# EAGLE design PCB - Pro Micro (EAGLE 9.6.2)
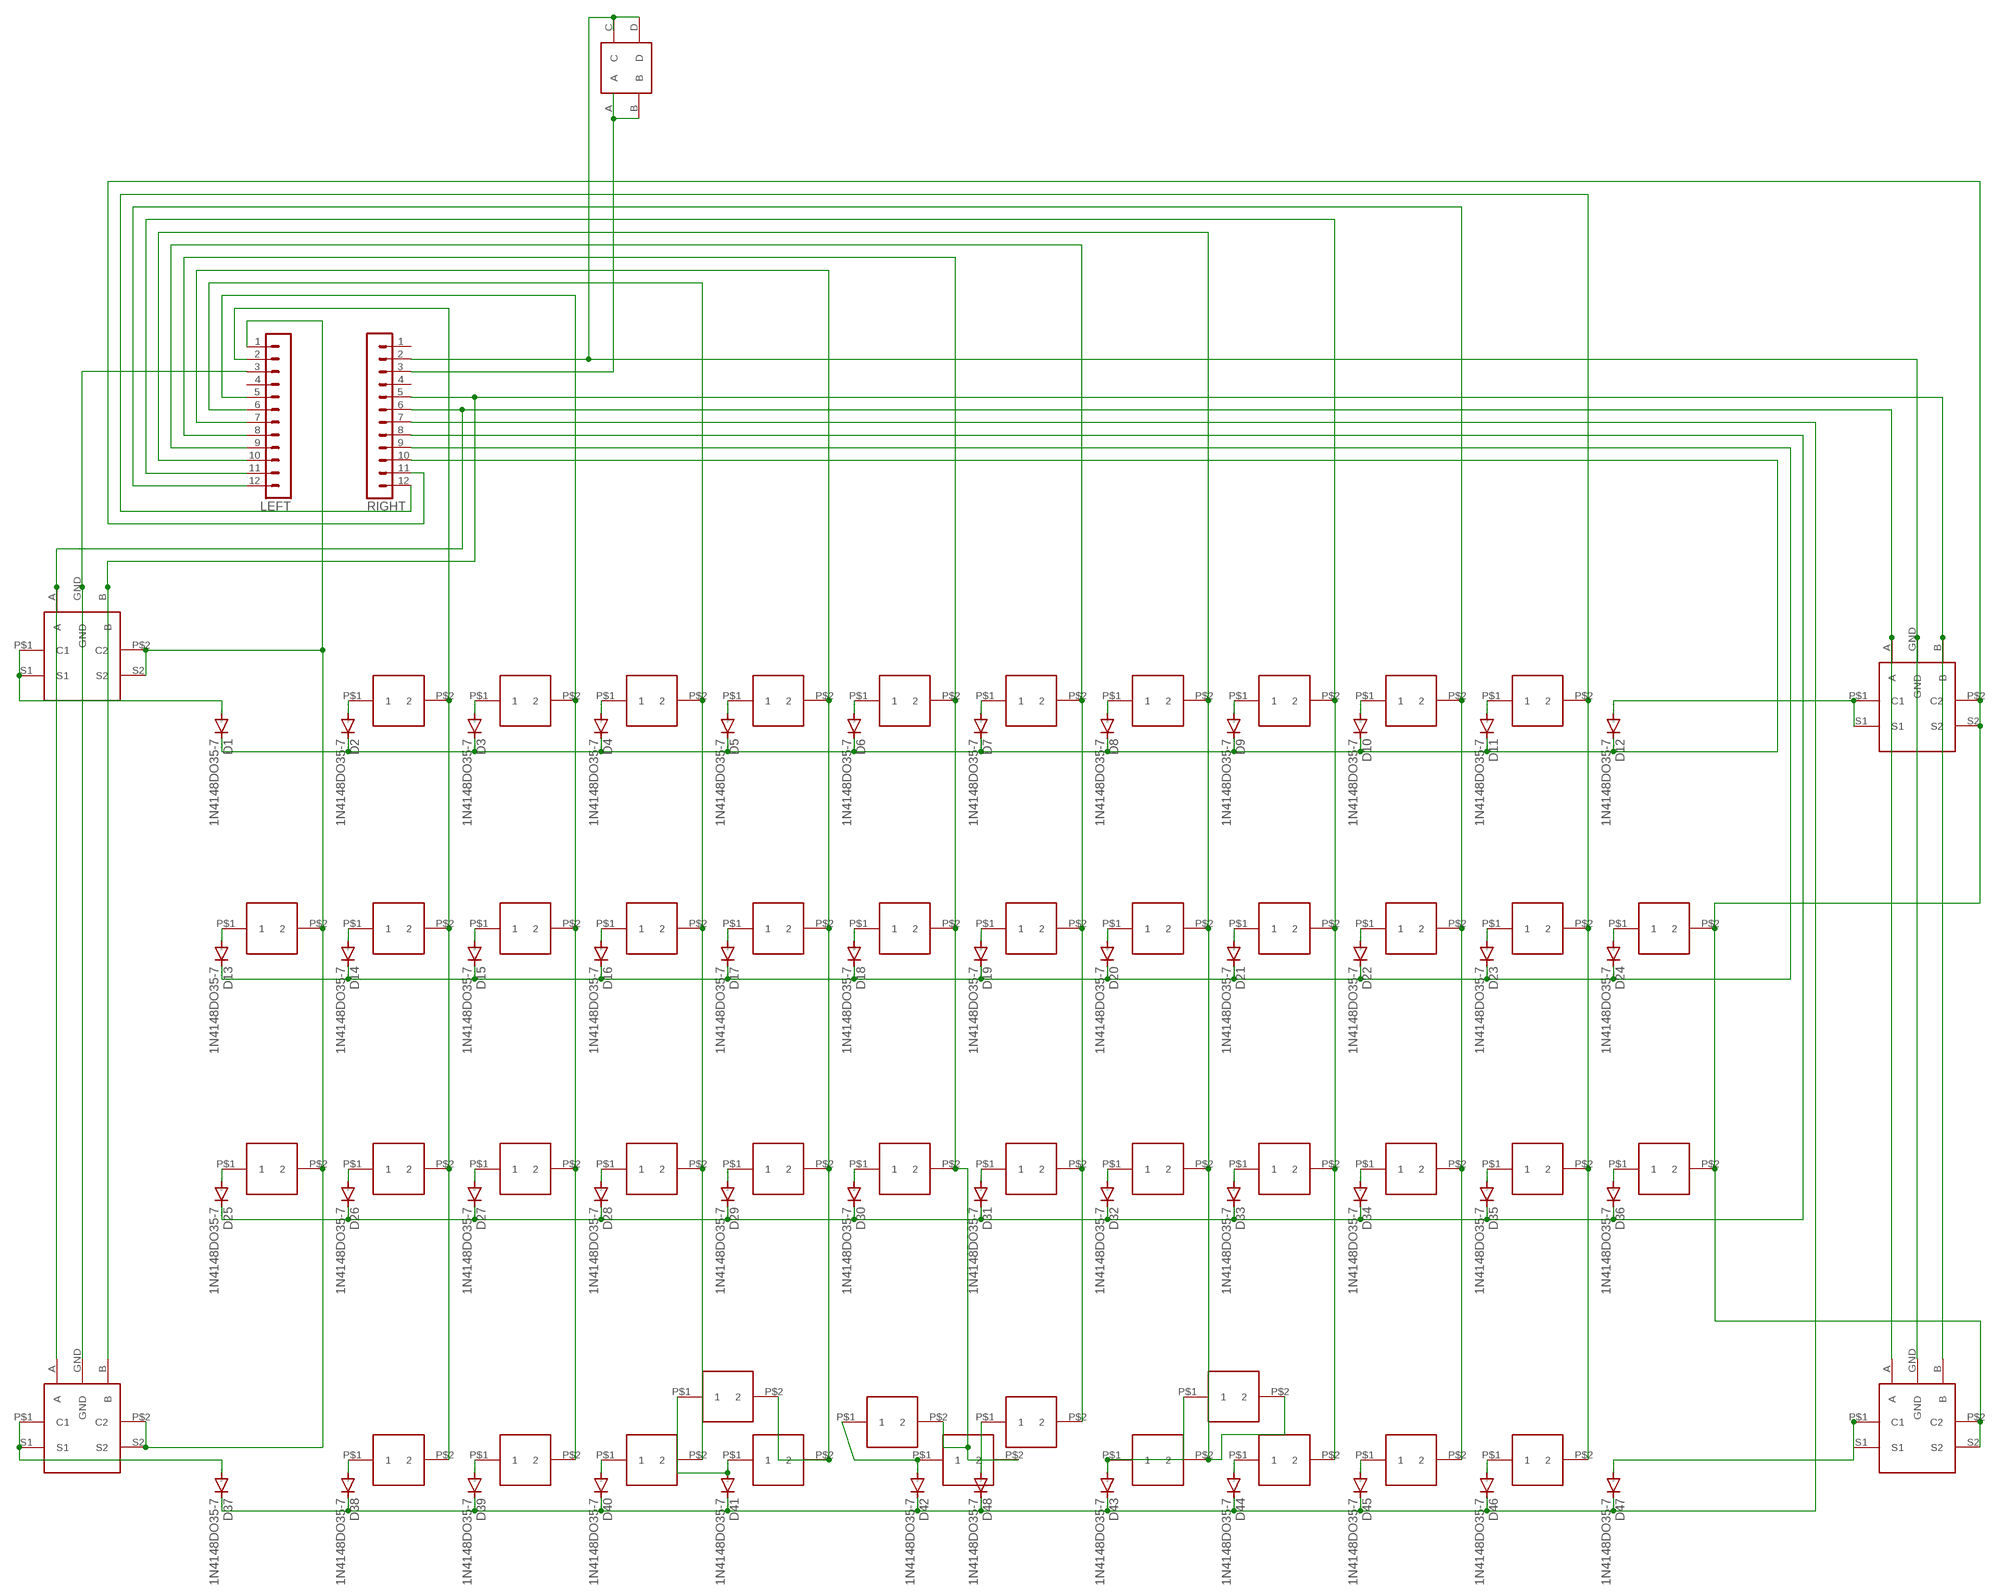
[diagram p0: schematic, sheet 1]

## Parts
1  CHERRY-SOLDER  [CHERRY-SOLDER]
2  CHERRY-SOLDER  [CHERRY-SOLDER]
3  CHERRY-SOLDER  [CHERRY-SOLDER]
4  CHERRY-SOLDER  [CHERRY-SOLDER]
12  CHERRY-SOLDER  [CHERRY-SOLDER]
13  CHERRY-SOLDER  [CHERRY-SOLDER]
14  CHERRY-SOLDER  [CHERRY-SOLDER]
15  CHERRY-SOLDER  [CHERRY-SOLDER]
16  CHERRY-SOLDER  [CHERRY-SOLDER]
17  CHERRY-SOLDER  [CHERRY-SOLDER]
18  CHERRY-SOLDER  [CHERRY-SOLDER]
19  CHERRY-SOLDER  [CHERRY-SOLDER]
21  CHERRY-SOLDER  [CHERRY-SOLDER]
22  CHERRY-SOLDER  [CHERRY-SOLDER]
23  CHERRY-SOLDER  [CHERRY-SOLDER]
24  CHERRY-SOLDER  [CHERRY-SOLDER]
25  CHERRY-SOLDER  [CHERRY-SOLDER]
26  CHERRY-SOLDER  [CHERRY-SOLDER]
27  CHERRY-SOLDER  [CHERRY-SOLDER]
28  CHERRY-SOLDER  [CHERRY-SOLDER]
29  CHERRY-SOLDER  [CHERRY-SOLDER]
31  CHERRY-SOLDER  [CHERRY-SOLDER]
32  CHERRY-SOLDER  [CHERRY-SOLDER]
33  CHERRY-SOLDER  [CHERRY-SOLDER]
34  CHERRY-SOLDER  [CHERRY-SOLDER]
35  CHERRY-SOLDER  [CHERRY-SOLDER]
36  CHERRY-SOLDER  [CHERRY-SOLDER]
37  CHERRY-SOLDER  [CHERRY-SOLDER]
38  CHERRY-SOLDER  [CHERRY-SOLDER]
39  CHERRY-SOLDER  [CHERRY-SOLDER]
42  CHERRY-SOLDER  [CHERRY-SOLDER]
43  CHERRY-SOLDER  [CHERRY-SOLDER]
44  CHERRY-SOLDER  [CHERRY-SOLDER]
45  CHERRY-SOLDER  [CHERRY-SOLDER]
46  CHERRY-SOLDER  [CHERRY-SOLDER]
47  CHERRY-SOLDER  [CHERRY-SOLDER]
48  CHERRY-SOLDER  [CHERRY-SOLDER]
49  CHERRY-SOLDER  [CHERRY-SOLDER]
110  CHERRY-SOLDER  [CHERRY-SOLDER]
111  CHERRY-SOLDER  [CHERRY-SOLDER]
210  CHERRY-SOLDER  [CHERRY-SOLDER]
211  CHERRY-SOLDER  [CHERRY-SOLDER]
212  CHERRY-SOLDER  [CHERRY-SOLDER]
310  CHERRY-SOLDER  [CHERRY-SOLDER]
311  CHERRY-SOLDER  [CHERRY-SOLDER]
312  CHERRY-SOLDER  [CHERRY-SOLDER]
410  CHERRY-SOLDER  [CHERRY-SOLDER]
D1  1N4148DO35-7  [DO35-7]
D2  1N4148DO35-7  [DO35-7]
D3  1N4148DO35-7  [DO35-7]
D4  1N4148DO35-7  [DO35-7]
D5  1N4148DO35-7  [DO35-7]
D6  1N4148DO35-7  [DO35-7]
D7  1N4148DO35-7  [DO35-7]
D8  1N4148DO35-7  [DO35-7]
D9  1N4148DO35-7  [DO35-7]
D10  1N4148DO35-7  [DO35-7]
D11  1N4148DO35-7  [DO35-7]
D12  1N4148DO35-7  [DO35-7]
D13  1N4148DO35-7  [DO35-7]
D14  1N4148DO35-7  [DO35-7]
D15  1N4148DO35-7  [DO35-7]
D16  1N4148DO35-7  [DO35-7]
D17  1N4148DO35-7  [DO35-7]
D18  1N4148DO35-7  [DO35-7]
D19  1N4148DO35-7  [DO35-7]
D20  1N4148DO35-7  [DO35-7]
D21  1N4148DO35-7  [DO35-7]
D22  1N4148DO35-7  [DO35-7]
D23  1N4148DO35-7  [DO35-7]
D24  1N4148DO35-7  [DO35-7]
D25  1N4148DO35-7  [DO35-7]
D26  1N4148DO35-7  [DO35-7]
D27  1N4148DO35-7  [DO35-7]
D28  1N4148DO35-7  [DO35-7]
D29  1N4148DO35-7  [DO35-7]
D30  1N4148DO35-7  [DO35-7]
D31  1N4148DO35-7  [DO35-7]
D32  1N4148DO35-7  [DO35-7]
D33  1N4148DO35-7  [DO35-7]
D34  1N4148DO35-7  [DO35-7]
D35  1N4148DO35-7  [DO35-7]
D36  1N4148DO35-7  [DO35-7]
D37  1N4148DO35-7  [DO35-7]
D38  1N4148DO35-7  [DO35-7]
D39  1N4148DO35-7  [DO35-7]
D40  1N4148DO35-7  [DO35-7]
D41  1N4148DO35-7  [DO35-7]
D42  1N4148DO35-7  [DO35-7]
D43  1N4148DO35-7  [DO35-7]
D44  1N4148DO35-7  [DO35-7]
D45  1N4148DO35-7  [DO35-7]
D46  1N4148DO35-7  [DO35-7]
D47  1N4148DO35-7  [DO35-7]
D48  1N4148DO35-7  [DO35-7]
LEFT  MA12-1  [MA12-1]
RIGHT  MA12-1  [MA12-1]
U$1  BUTTON  [BUTTON]
U$2  CHERRY-ENCODER  [CHERRY-ENCODER]
U$3  CHERRY-ENCODER  [CHERRY-ENCODER]
U$4  CHERRY-ENCODER  [CHERRY-ENCODER]
U$5  CHERRY-ENCODER  [CHERRY-ENCODER]

## Nets
N$1: 3.P$2 15.P$2 25.P$2 35.P$2 45.P$2 LEFT.7
N$2: 12.P$1 D2.A
N$3: 13.P$1 D3.A
N$4: 14.P$1 D4.A
N$5: 15.P$1 D5.A
N$6: 16.P$1 D6.A
N$7: 17.P$1 D7.A
N$8: 18.P$1 D8.A
N$9: 19.P$1 D9.A
N$10: 110.P$1 D10.A
N$11: 111.P$1 D11.A
N$12: D12.A U$2.P$1(C1) U$2.S1
N$13: 21.P$1 D13.A
N$14: 22.P$1 D14.A
N$15: 23.P$1 D15.A
N$16: 24.P$1 D16.A
N$17: 25.P$1 D17.A
N$18: 26.P$1 D18.A
N$19: 27.P$1 D19.A
N$20: 28.P$1 D20.A
N$21: 29.P$1 D21.A
N$22: 210.P$1 D22.A
N$23: 211.P$1 D23.A
N$24: 212.P$1 D24.A
N$25: 31.P$1 D25.A
N$26: 32.P$1 D26.A
N$27: 33.P$1 D27.A
N$28: 34.P$1 D28.A
N$29: 35.P$1 D29.A
N$30: 36.P$1 D30.A
N$31: 37.P$1 D31.A
N$32: 38.P$1 D32.A
N$33: 39.P$1 D33.A
N$34: 310.P$1 D34.A
N$35: 311.P$1 D35.A
N$36: 312.P$1 D36.A
N$37: 21.P$2 31.P$2 LEFT.1 U$3.P$2(C2) U$3.S2 U$4.P$2(C2) U$4.S2
N$38: 42.P$1 D38.A
N$39: 43.P$1 D39.A
N$40: 44.P$1 D40.A
N$41: 3.P$1 45.P$1 D41.A
N$42: 1.P$1 46.P$1 D42.A
N$43: 4.P$1 47.P$1 D43.A
N$44: 48.P$1 D44.A
N$45: 49.P$1 D45.A
N$46: 410.P$1 D46.A
N$47: D47.A U$5.P$1(C1) U$5.S1
N$49: D37.A U$4.P$1(C1) U$4.S1
N$50: 212.P$2 312.P$2 RIGHT.11 U$2.P$2(C2) U$2.S2 U$5.P$2(C2) U$5.S2
N$51: 12.P$2 22.P$2 32.P$2 42.P$2 LEFT.2
N$55: D37.C D38.C D39.C D40.C D41.C D42.C D43.C D44.C D45.C D46.C D47.C D48.C RIGHT.7
N$56: D1.C D2.C D3.C D4.C D5.C D6.C D7.C D8.C D9.C D10.C D11.C D12.C RIGHT.10
N$57: D13.C D14.C D15.C D16.C D17.C D18.C D19.C D20.C D21.C D22.C D23.C D24.C RIGHT.9
N$58: D25.C D26.C D27.C D28.C D29.C D30.C D31.C D32.C D33.C D34.C D35.C D36.C RIGHT.8
N$59: RIGHT.2 U$1.C U$1.D U$2.GND U$5.GND
N$60: LEFT.3 U$3.GND U$4.GND
N$63: 13.P$2 23.P$2 33.P$2 43.P$2 LEFT.5
N$64: 111.P$2 211.P$2 311.P$2 410.P$2 RIGHT.12
N$67: RIGHT.6 U$2.A U$3.A U$4.A U$5.A
N$68: D1.A U$3.P$1(C1) U$3.S1
N$69: 14.P$2 24.P$2 34.P$2 44.P$2 LEFT.6
N$70: RIGHT.5 U$2.B U$3.B U$4.B U$5.B
N$72: 2.P$1 D48.A
N$74: 2.P$2 17.P$2 27.P$2 37.P$2 LEFT.9
N$75: 49.P$2 110.P$2 210.P$2 310.P$2 LEFT.12
N$93: 1.P$2 16.P$2 26.P$2 36.P$2 46.P$2 LEFT.8
N$123: RIGHT.3 U$1.A U$1.B
N$126: 4.P$2 18.P$2 28.P$2 38.P$2 47.P$2 LEFT.10
N$128: 19.P$2 29.P$2 39.P$2 48.P$2 LEFT.11
Unconnected: LEFT.4 RIGHT.1 RIGHT.4

## Library data of the parts
1-4 12-19 21-29 31-39 42-49 110 111 210-212 310-312 410 = Volume_V1:CHERRY-SOLDER
D1-D48 = diode:1N4148: DIODE high speed (Philips)
LEFT RIGHT = con-lstb:MA12-1: PIN HEADER; OC_FARNELL: unknown; OC_NEWARK: unknown
U$1 = Volume_V1:BUTTON
U$2-U$5 = Volume_V1:CHERRY-ENCODER

## Board
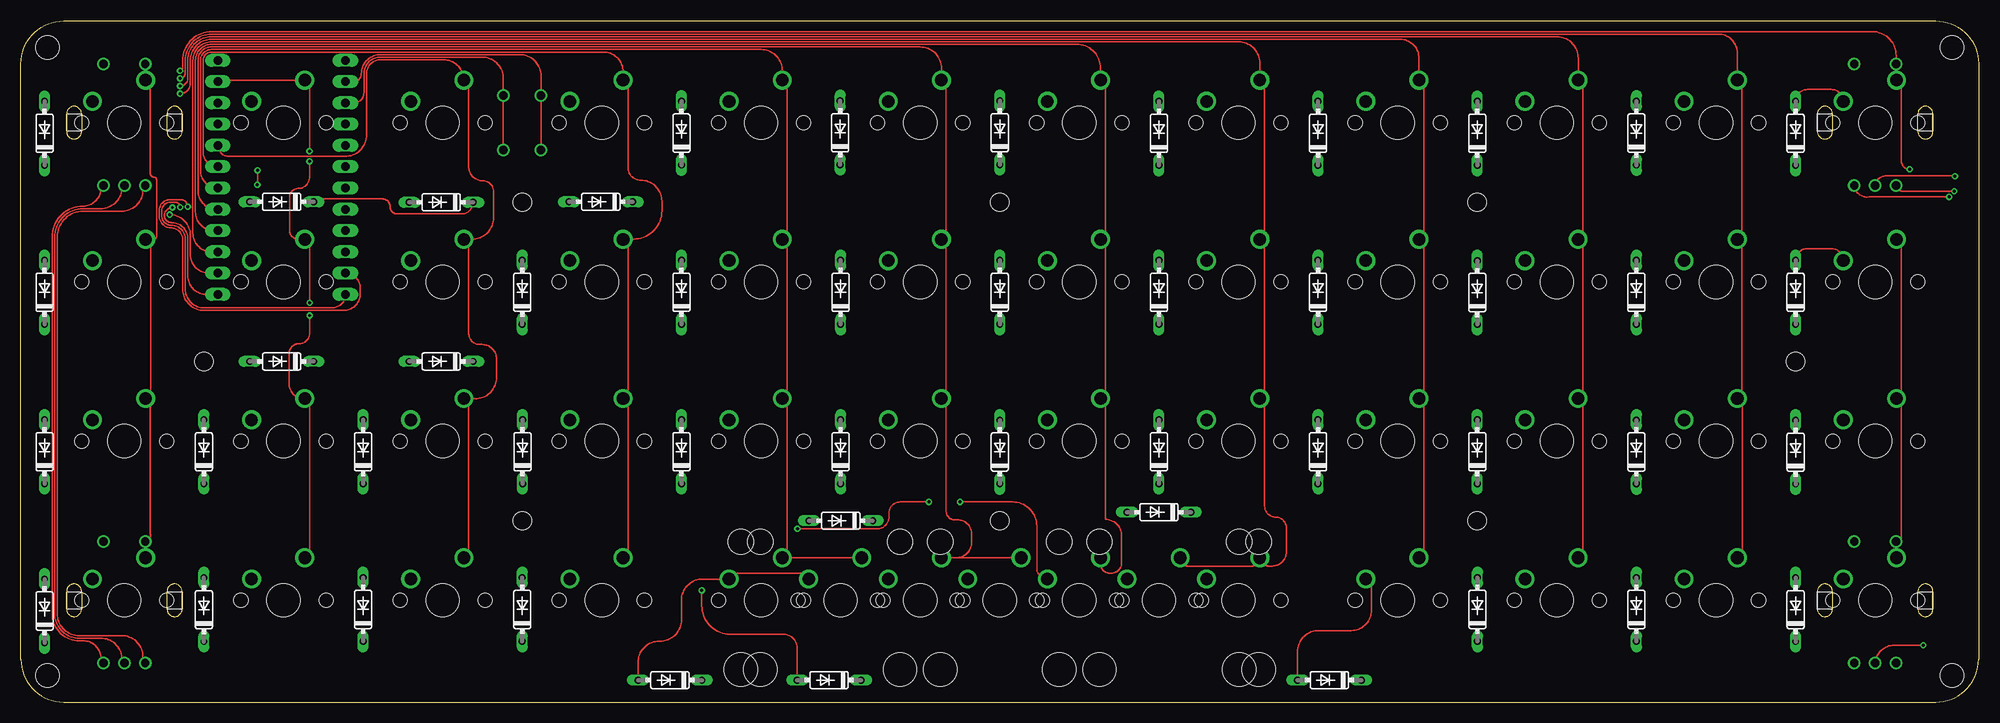
[diagram p1: board, top side]
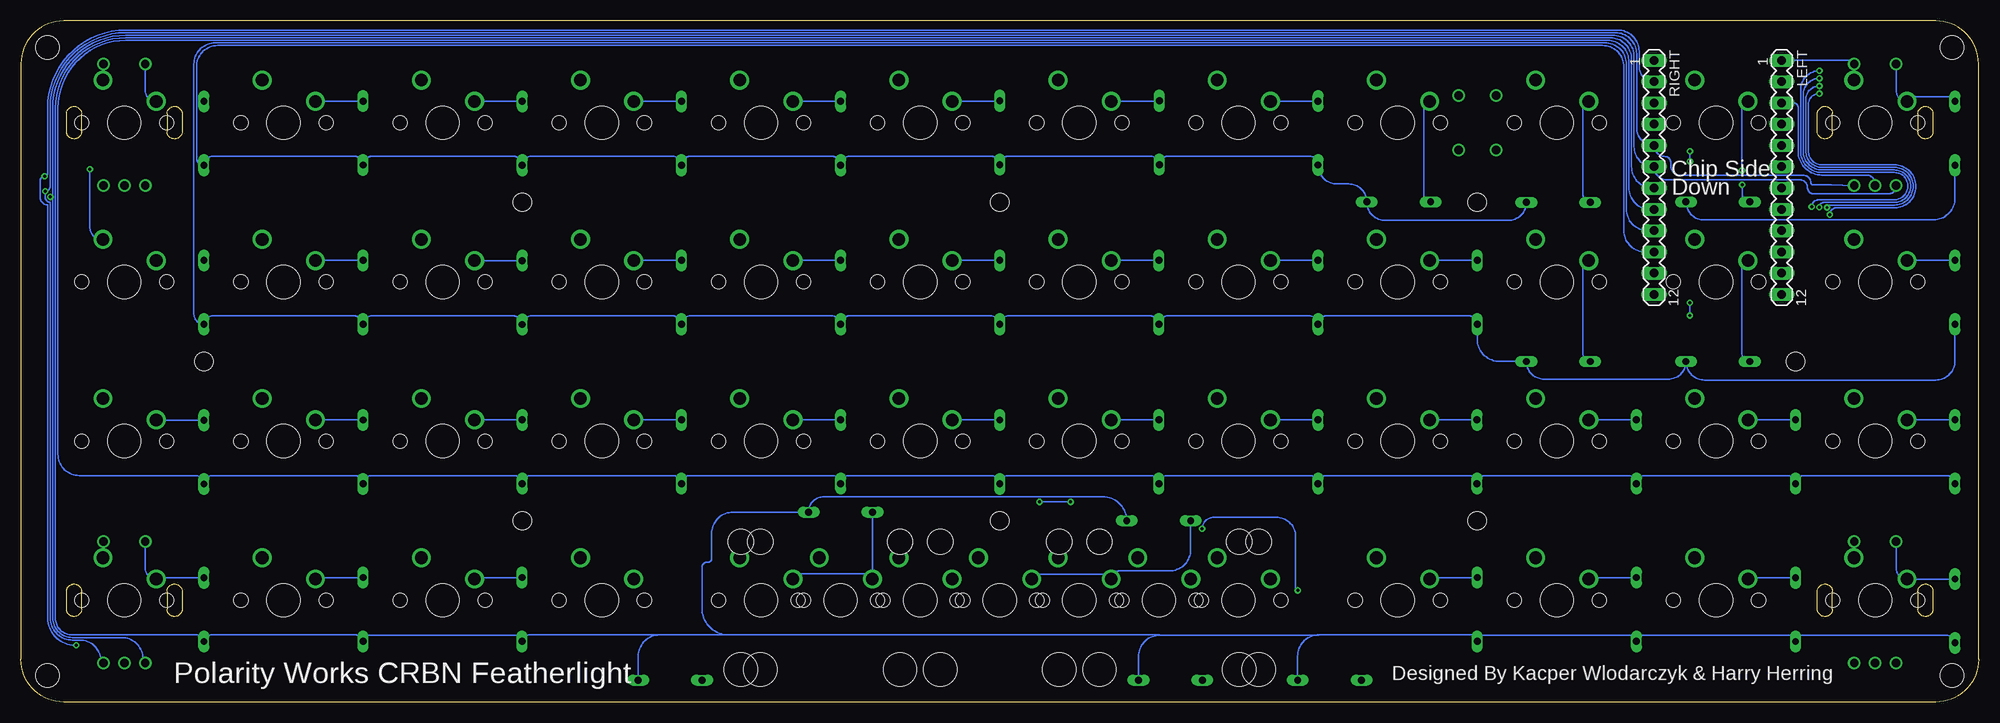
[diagram p2: board, bottom side, seen from below]

Size 233.68 x 81.28 mm. Coordinates in mm from the lower left corner, seen from the top.
Outline: 5.08,0 228.6,0 arc90 233.68,5.08 233.68,76.2 arc90 228.6,81.28 5.08,81.28 arc90 0,76.2 0,5.08 arc90 5.08,0
Copper layers (1*16): Top 0.035mm / dielectric 1.5mm / Bottom 0.035mm
Design rules "default": minimum track width 6mil, minimum drill 0.35mm, track to track 6mil, track to pad 6mil, pad to pad 6mil, via to via 6mil, smd to smd 6mil, copper to edge 40mil, drill to drill 6mil, minimum pad ring 10mil, minimum via ring 8mil, stop-mask expansion 4mil, vias tented up to drill 0mil, thermal gap 10mil
Holes 2.79 mm at 3.17,3.17 3.17,78.11 230.5,78.11 230.5,3.17
Holes 2.2 mm at 116.84,59.64 116.84,21.64 173.84,21.64 211.84,40.64 173.84,59.64 59.84,59.64 59.84,21.64 21.84,40.64
Holes 3.05 mm at 109.74,19.12 128.74,19.12 104.94,19.12 85.94,19.12 123.94,19.12 147.74,19.12 88.27,19.12 145.41,19.12
Holes 3.99 mm at 109.74,3.88 128.74,3.88 104.94,3.88 85.94,3.88 123.94,3.88 147.74,3.88 88.27,3.88 145.41,3.88

### Footprints (pad centres in the part's own frame; a part is rotated, then mirrored left to right if it is on the bottom)
CHERRY-SOLDER = drill 1.499: P$1 -3.81,2.54; P$2 2.54,5.08 | hole 3.988: 0,0 | hole 1.702: -5.08,0; 5.08,0
DO35-7 = drill 0.813 long: A 3.81,0; C -3.81,0
MA12-1 = drill 1.016 long: 1 -13.97,0; 2 -11.43,0; 3 -8.89,0; 4 -6.35,0; 5 -3.81,0; 6 -1.27,0; 7 1.27,0; 8 3.81,0; 9 6.35,0; 10 8.89,0; 11 11.43,0; 12 13.97,0
BUTTON = drill 1: A 0,0; B 0,6.5; C 4.5,6.5; D 4.5,0
CHERRY-ENCODER = drill 0.991: A -2.5,-7.5; B 2.5,-7.5; GND 0,-7.5; S1 -2.5,7; S2 2.5,7 | drill 1.499: P$1 -3.81,2.54; P$2 2.54,5.08 | hole 3.988: 0,0 | hole 1.702: -5.08,0; 5.08,0

### Placement (x,y rotation side)
1  107.34,12.14 0 top
2  126.34,12.14 0 top
3  97.84,12.14 0 top
4  135.84,12.14 0 top
12  31.34,69.14 0 top
13  50.34,69.14 0 top
14  69.34,69.14 0 top
15  88.34,69.14 0 top
16  107.34,69.14 0 top
17  126.34,69.14 0 top
18  145.34,69.14 0 top
19  164.34,69.14 0 top
21  12.34,50.14 0 top
22  31.34,50.14 0 top
23  50.34,50.14 0 top
24  69.34,50.14 0 top
25  88.34,50.14 0 top
26  107.34,50.14 0 top
27  126.34,50.14 0 top
28  145.34,50.14 0 top
29  164.34,50.14 0 top
31  12.34,31.14 0 top
32  31.34,31.14 0 top
33  50.34,31.14 0 top
34  69.34,31.14 0 top
35  88.34,31.14 0 top
36  107.34,31.14 0 top
37  126.34,31.14 0 top
38  145.34,31.14 0 top
39  164.34,31.14 0 top
42  31.34,12.14 0 top
43  50.34,12.14 0 top
44  69.34,12.14 0 top
45  88.34,12.14 0 top
46  116.84,12.14 0 top
47  145.34,12.14 0 top
48  164.34,12.14 0 top
49  183.34,12.14 0 top
110  183.34,69.14 0 top
111  202.34,69.14 0 top
210  183.34,50.14 0 top
211  202.34,50.14 0 top
212  221.34,50.14 0 top
310  183.34,31.14 0 top
311  202.34,31.14 0 top
312  221.34,31.14 0 top
410  202.34,12.14 0 top
D1  2.82,67.87 90 top
D2  31.11,59.69 180 top
D3  50.16,59.64 180 top
D4  69.22,59.69 180 top
D5  78.84,67.89 90 top
D6  97.79,67.94 90 top
D7  116.84,67.94 90 top
D8  135.84,67.87 90 top
D9  154.84,67.87 90 top
D10  173.84,67.87 90 top
D11  192.84,67.89 90 top
D12  211.84,67.87 90 top
D13  2.82,48.9 90 top
D14  31.11,40.64 180 top
D15  50.16,40.64 180 top
D16  59.84,48.9 90 top
D17  78.84,48.9 90 top
D18  97.84,48.9 90 top
D19  116.84,48.9 90 top
D20  135.84,48.9 90 top
D21  154.84,48.9 90 top
D22  173.84,48.87 90 top
D23  192.84,48.9 90 top
D24  211.84,48.9 90 top
D25  2.82,29.87 90 top
D26  21.84,29.87 90 top
D27  40.84,29.87 90 top
D28  59.87,29.87 90 top
D29  78.84,29.87 90 top
D30  97.84,29.87 90 top
D31  116.84,29.84 90 top
D32  135.84,29.87 90 top
D33  154.84,29.87 90 top
D34  173.84,29.87 90 top
D35  192.84,29.84 90 top
D36  211.84,29.82 90 top
D37  2.82,10.87 90 top
D38  21.84,11.02 90 top
D39  40.84,11.05 90 top
D40  59.84,11.05 90 top
D41  77.47,2.62 180 top
D42  97.87,21.64 180 top
D43  135.84,22.66 180 top
D44  156.19,2.62 180 top
D45  173.86,11.05 90 top
D46  192.84,11.05 90 top
D47  211.84,11.02 90 top
D48  96.47,2.62 180 top
LEFT  23.5,62.61 270 bottom
RIGHT  38.73,62.61 270 bottom
U$1  57.58,65.86 0 top
U$2  221.34,69.14 0 top
U$3  12.34,69.14 0 top
U$4  12.34,12.14 0 top
U$5  221.34,12.14 0 top

### Tracks (layer width: path | path; a pad name or v marks a point on that pad's centre or on a via)
N$1
  Top 0.152: 3.P$2 45.P$2 arc90 91.47,17.8 91.47,35.52 arc90 35.P$2 arc90 91.47,36.87 91.47,54.57 arc90 25.P$2 arc90 91.47,55.93 91.47,73.64 arc90 15.P$2 90.88,75.34 arc90 88.34,77.88 88.16,77.88 22.73,77.88 arc90 21.44,76.58 21.44,63.4 arc90 LEFT.7
N$2  (via drill 0.35)
  Top 0.152: v28.25,63.45 28.25,61.75 arc-90 v28.22,61.73
  Bottom 0.152: 12.P$1 arc-90 28.25,70.97 v28.25,63.45 | v28.22,61.73 28.22,60.6 arc-90 D2.A
N$3
  Bottom 0.152: 13.P$1 arc-90 47.22,70.86 47.22,60.5 arc-90 D3.A
N$4
  Bottom 0.152: 14.P$1 arc-90 66.22,70.93 66.22,60.5 arc-90 D4.A
N$5
  Bottom 0.152: 15.P$1 78.87,71.68 arc-90 D5.A
N$6
  Bottom 0.152: 16.P$1 97.86,71.68 arc-90 D6.A
N$7
  Bottom 0.152: 17.P$1 116.92,71.68 arc-90 D7.A
N$8
  Bottom 0.152: 18.P$1 D8.A arc-90 D8.A
N$9
  Bottom 0.152: 19.P$1 D9.A arc-90 D9.A
N$10
  Bottom 0.152: 110.P$1 D10.A arc-90 D10.A
N$11
  Bottom 0.152: 111.P$1 192.86,71.68 arc-90 D11.A
N$12
  Top 0.152: D12.A arc-90 213.26,73.1 216.11,73.1 arc-90 U$2.P$1
  Bottom 0.152: U$2.P$1 arc90 218.84,72.99 U$2.S1
N$13
  Bottom 0.152: D13.A 8.51,52.7 arc-90 21.P$1
N$14
  Bottom 0.152: 22.P$1 arc-90 28.25,51.66 28.25,41.58 arc-90 D14.A
N$15
  Bottom 0.152: 23.P$1 arc-90 47.22,51.8 47.22,41.5 arc-90 D15.A
N$16
  Bottom 0.152: D16.A 65.5,52.7 arc-90 24.P$1
N$17
  Bottom 0.152: D17.A 84.5,52.7 arc-90 25.P$1
N$18
  Bottom 0.152: D18.A 103.5,52.7 arc-90 26.P$1
N$19
  Bottom 0.152: D19.A 122.5,52.7 arc-90 27.P$1
N$20
  Bottom 0.152: D20.A 141.5,52.7 arc-90 28.P$1
N$21
  Bottom 0.152: D21.A 160.5,52.7 arc-90 29.P$1
N$22
  Bottom 0.152: 210.P$1 | 210.P$1 D22.A
N$23
  Bottom 0.152: D23.A 198.5,52.7 arc-90 211.P$1
N$24
  Top 0.152: D24.A arc-90 213.23,54.1 216.11,54.1 arc-90 212.P$1
N$25
  Bottom 0.152: 31.P$1 D25.A arc90 D25.A
N$26
  Bottom 0.152: 32.P$1 D26.A | D26.A arc90 D26.A
N$27
  Bottom 0.152: 33.P$1 D27.A arc90 D27.A
N$28
  Bottom 0.152: 34.P$1 D28.A | D28.A arc90 D28.A
N$29
  Bottom 0.152: 35.P$1 D29.A | D29.A arc90 D29.A
N$30
  Bottom 0.152: 36.P$1 D30.A | D30.A arc90 D30.A
N$31
  Bottom 0.152: 37.P$1 116.86,33.68 arc90 D31.A
N$32
  Bottom 0.152: 38.P$1 D32.A arc90 D32.A
N$33
  Bottom 0.152: 39.P$1 D33.A arc90 D33.A
N$34
  Bottom 0.152: 310.P$1 D34.A | D34.A arc90 D34.A
N$35
  Bottom 0.152: 311.P$1 192.86,33.68 arc90 D35.A
N$36
  Bottom 0.152: D36.A 217.48,33.63 arc90 312.P$1
N$37
  Top 0.152: U$4.P$2 14.88,19.1 arc90 U$4.S2 arc90 15.44,20.09 15.44,35.11 arc90 31.P$2 arc90 15.47,37.28 15.47,54.16 arc90 21.P$2 15.93,55.24 arc90 16.18,55.5 16.18,62.36 arc90 15.9,62.64 arc-90 15.44,63.09 15.44,73.29 arc90 U$3.P$2 14.88,76.1 arc90 U$3.S2
  Bottom 0.152: U$3.S2 arc-90 15.28,76.58 LEFT.1
N$38
  Bottom 0.152: D38.A 27.38,14.83 arc-90 42.P$1
N$39
  Bottom 0.152: D39.A 46.35,14.86 arc-90 43.P$1
N$40
  Bottom 0.152: D40.A 65.35,14.86 arc-90 44.P$1
N$41
  Top 0.152: D41.A 73.66,3.43 73.66,4.72 arc-90 76.2,7.26 76.3,7.26 arc90 78.84,9.8 78.84,12.14 arc-90 81.38,14.68 45.P$1 arc-90 85.22,15.37 93.34,15.37 arc-90 3.P$1
N$42
  Bottom 0.152: 46.P$1 arc90 112.36,15.27 104.17,15.27 arc90 1.P$1 arc90 102.56,15.65 96.57,15.65 arc-90 94.06,18.16 D42.A
N$43
  Bottom 0.152: D43.A arc-90 D43.A 4.P$1 arc-90 132.67,15.32 140.89,15.32 arc-90 47.P$1
N$44
  Top 0.152: 48.P$1 arc-90 161.21,14 161.21,11.58 161.21,11.45 161.21,10.92 arc-90 158.83,8.53 154.92,8.53 arc90 152.38,5.99 D44.A
N$45
  Bottom 0.152: D45.A 179.35,14.86 arc-90 49.P$1
N$46
  Bottom 0.152: D46.A 198.35,14.86 arc-90 410.P$1
N$47
  Bottom 0.152: D47.A 217.38,14.83 arc-90 U$5.P$1 arc90 218.84,15.99 U$5.S1
N$49
  Bottom 0.152: D37.A arc90 D37.A U$4.P$1 arc90 9.84,15.99 U$4.S1
N$50  (via drill 0.35)
  Top 0.152: 212.P$2 arc-90 224.43,54.86 224.43,36.58 arc-90 312.P$2 arc-90 224.43,35.83 224.43,19.5 arc-90 U$5.S2 223.84,17.26 arc90 U$5.P$2 | v225.45,63.58 arc-90 224.46,64.57 224.46,73.88 arc90 U$2.P$2 223.88,76.1 arc90 U$2.S2 223.84,77.17 arc90 221,80.01 22.73,80.01 arc90 19.3,76.58 19.3,75.64 arc-90 v19,75.34 | RIGHT.11 arc-90 40.51,49.4 40.51,48.74 arc-90 38.51,46.74 21.84,46.74 arc-90 19.3,49.28 19.3,55.22 arc90 17.93,56.59 arc-90 16.51,58.01 16.51,58.67 arc-90 17.78,59.94 19.08,59.94 arc-90 v19.92,59.11
  Bottom 0.152: v225.45,63.58 225.45,56.54 arc-90 212.P$2 | v19,75.34 arc-90 21.23,73.1 21.23,65.73 arc-90 18.69,63.2 10.03,63.2 arc90 8.43,61.59 arc90 10.1,59.93 19.09,59.93 arc-90 v19.92,59.11
N$51  (via drill 0.35)
  Top 0.152: 42.P$2 arc90 34.47,18.07 34.47,35.19 arc90 32.P$2 arc-90 32.03,37.82 32.03,41.63 arc-90 33.15,42.75 arc90 34.47,44.07 v34.47,46.13 | v34.44,64.52 34.44,62.61 arc-90 33.12,61.29 arc90 32.05,60.22 32.05,56.31 arc90 33.12,55.24 22.P$2 arc-90 34.47,54.28 34.47,49.4 34.47,49.23 v34.47,47.65 | v34.44,65.73 34.44,73.42 arc90 12.P$2 23.67,74.22 arc90 LEFT.2
  Bottom 0.152: v34.44,64.52 v34.44,65.73 | v34.47,47.65 v34.47,46.13
N$55
  Bottom 0.152: D37.C arc-90 4.05,7.98 20.82,7.98 arc-90 D38.C arc-90 22.87,7.98 39.85,7.98 arc-90 D39.C arc-90 41.83,7.98 59.11,7.98 arc-90 D40.C arc-90 60.63,8.03 78.74,8.03 | 97.74,7.98 78.79,7.98 arc-90 78.74,8.03 | 97.74,7.98 arc-90 100.28,5.44 D48.C | 97.74,7.98 arc-90 97.77,8 149.17,8 | 149.17,8 arc90 152.4,11.23 152.4,16.08 arc90 151.79,16.69 151.66,16.69 arc-90 151.23,17.12 151.23,20.12 arc90 148.69,22.66 D43.C 139.68,22.66 arc90 137.85,24.49 104.52,24.49 arc90 D42.C | RIGHT.7 38.89,61.34 arc90 41.43,63.88 41.43,76.73 arc-90 43.97,79.27 221.16,79.27 arc-90 229.56,70.87 229.56,10.01 arc-90 227.56,8 212.89,8 arc90 D47.C arc90 210.79,8 193.85,8 arc90 D46.C arc90 191.85,7.98 174.85,7.98 arc90 D45.C arc90 173.1,8 157.46,8 | 149.17,8 157.46,8 | 78.74,8.03 arc-90 81.28,5.49 D41.C | 157.46,8 arc-90 160,5.46 D44.C
N$56
  Top 0.152: D2.C arc-90 35.28,60.05 43.13,60.05 arc-90 44.07,59.11 arc90 44.93,58.24 52.58,58.24 arc90 D3.C
  Bottom 0.152: D3.C arc90 56.13,57.48 70.81,57.48 arc90 D4.C arc-90 75.16,61.82 76.58,61.82 arc90 D5.C 78.82,64.08 arc-90 79.86,65.13 96.8,65.13 arc-90 D6.C arc-90 98.78,65.13 115.85,65.13 arc-90 D7.C arc-90 117.83,65.13 134.77,65.13 arc-90 D8.C arc-90 136.91,65.13 153.77,65.13 arc-90 D9.C arc-90 155.91,65.13 172.77,65.13 arc-90 D10.C arc-90 174.9,65.13 191.79,65.13 arc-90 D11.C arc-90 193.88,65.13 210.77,65.13 arc-90 D12.C arc90 212.72,64.95 212.72,75.82 arc90 210.19,78.36 44.88,78.36 arc90 42.34,75.82 42.34,56.26 arc-90 39.8,53.72 RIGHT.10 | D1.C 2.82,60.1 arc90 5.36,57.56 32.74,57.56 arc-90 32.77,57.53 arc90 D2.C
N$57
  Bottom 0.152: D13.C 2.82,40.69 arc90 5.08,38.43 32.72,38.43 arc90 D14.C arc90 37.03,38.53 51.87,38.53 arc90 D15.C 57.15,40.64 arc90 59.84,43.33 D16.C arc-90 60.86,46.1 77.83,46.1 arc-90 D17.C arc-90 79.83,46.08 96.85,46.08 arc-90 D18.C arc-90 98.83,46.08 115.85,46.08 arc-90 D19.C arc-90 117.83,46.08 134.85,46.08 arc-90 D20.C arc-90 136.83,46.08 153.85,46.08 arc-90 D21.C arc-90 155.83,46.08 172.82,46.08 arc-90 D22.C arc-90 174.85,46.08 191.85,46.08 arc-90 D23.C arc-90 193.83,46.08 210.84,46.08 arc-90 D24.C arc90 213.03,46.28 213.03,76.12 arc90 210.49,78.66 206.45,78.66 44.58,78.66 arc90 42.04,76.12 42.04,58.8 arc-90 39.5,56.26 RIGHT.9
N$58
  Bottom 0.152: D25.C arc-90 3.79,27.03 20.88,27.03 arc-90 D26.C arc-90 22.81,27.03 39.88,27.03 arc-90 D27.C arc-90 41.81,27.03 58.9,27.03 arc-90 D28.C arc-90 60.83,27.03 77.88,27.03 arc-90 D29.C arc-90 79.81,27.03 96.88,27.03 arc-90 D30.C arc-90 98.81,27.03 115.85,27.03 arc-90 D31.C arc-90 117.83,27.03 134.87,27.03 arc-90 D32.C arc-90 136.8,27.03 153.87,27.03 arc-90 D33.C arc-90 155.8,27.03 172.87,27.03 arc-90 D34.C arc-90 174.8,27.03 191.85,27.03 arc-90 D35.C arc-90 193.83,27.03 210.82,27.03 arc-90 D36.C arc-90 212.85,27.03 226.72,27.03 arc90 229.26,29.57 229.26,70.87 arc90 221.16,78.97 44.27,78.97 arc90 41.73,76.43 41.73,61.34 arc-90 39.19,58.8 RIGHT.8
N$59  (via drill 0.35)
  Top 0.152: U$2.GND arc-90 222.69,62.79 230.81,62.79 arc-90 v230.86,62.74 | v227.08,6.79 223.84,6.79 arc90 U$5.GND | RIGHT.2 39.7,74.04 arc90 40.64,74.98 arc-90 42.93,77.27 59.54,77.27 arc-90 62.08,74.73 U$1.C U$1.D
  Bottom 0.152: v227.08,6.79 227.25,6.79 arc90 230.48,10.01 230.48,59.33 arc90 231.39,60.25 231.39,62.2 arc90 v230.86,62.74 arc-90 230.5,63.09 230.5,70.84 arc90 221.16,80.19 43.05,80.19 arc90 40.51,77.65 40.51,75.82 arc-90 RIGHT.2
N$60
  Top 0.152: U$4.GND 12.06,5.08 arc90 9.53,7.62 6.96,7.62 arc-90 4.01,10.57 4.01,55.47 arc-90 7.42,58.88 9.53,58.88 arc90 12.06,61.42 U$3.GND
  Bottom 0.152: U$3.GND arc-90 13.24,62.89 18.7,62.89 arc90 21.54,65.73 21.54,70.97 arc-90 22.07,71.5 LEFT.3
N$63
  Top 0.152: 43.P$2 arc90 53.47,17.96 53.47,35.33 arc90 33.P$2 54.23,36.2 arc90 56.77,38.73 56.77,40.95 arc90 55.04,42.67 54.71,42.67 arc-90 53.47,43.92 53.47,54.4 arc90 23.P$2 53.87,55.24 arc90 56.41,57.78 56.41,60.94 arc90 55.14,62.2 arc-90 53.44,63.91 53.44,73.52 arc90 13.P$2 arc90 50.44,76.66 42.93,76.66 arc90 41.25,74.98 41.25,67.67 arc-90 38.71,65.13 24.79,65.13 arc-90 LEFT.5
N$64  (via drill 0.35)
  Top 0.152: 410.P$2 arc90 205.46,17.58 205.46,35.79 arc90 311.P$2 arc90 205.44,36.6 205.44,54.84 arc90 211.P$2 arc90 205.44,55.63 205.44,73.88 arc90 111.P$2 204.88,77.47 arc90 202.65,79.7 22.73,79.7 arc90 19.61,76.58 19.61,75.06 arc-90 v19,74.43 | RIGHT.12 arc-90 37.13,47.04 21.84,47.04 arc-90 19.61,49.28 19.61,55.27 arc90 17.98,56.9 17.93,56.9 arc-90 16.82,58.01 16.82,58.65 arc-90 17.8,59.64 18.42,59.64 arc-90 v19.01,59.05
  Bottom 0.152: v19,74.43 arc-90 20.93,72.5 20.93,65.73 arc-90 18.69,63.5 10.03,63.5 arc90 8.1,61.57 arc90 10.05,59.63 18.44,59.63 arc-90 v19.01,59.05
N$67  (via drill 0.35)
  Top 0.152: U$2.A arc90 220.56,60.27 v230.17,60.27 | U$4.A 9.56,5.17 arc90 7.42,7.32 6.96,7.32 arc-90 3.71,10.57 3.71,55.47 arc-90 7.42,59.18 arc90 9.56,61.33 U$3.A
  Bottom 0.152: U$5.A 219.12,5.17 arc-90 221.64,7.7 227.56,7.7 arc90 229.87,10.01 229.87,59.97 arc-90 v230.17,60.27 arc-90 229.89,60.55 229.89,70.84 arc90 221.16,79.58 43.66,79.58 arc90 41.12,77.04 41.12,66.27 arc-90 RIGHT.6 arc-90 37.19,62.33 21.36,62.33 arc90 20.42,61.39 arc-90 19.68,60.66 10.61,60.66 arc-90 U$3.A
N$68
  Bottom 0.152: U$3.S1 9.84,72.99 arc-90 U$3.P$1 8,72.21 3.35,72.21 arc-90 D1.A
N$69
  Top 0.152: 44.P$2 arc90 72.47,17.87 72.47,35.43 arc90 34.P$2 arc90 72.47,36.94 72.47,54.5 arc90 24.P$2 73.13,55.24 arc90 76.5,58.62 76.5,59.74 arc90 73.97,62.28 arc-90 72.47,63.78 72.47,73.57 arc90 14.P$2 71.88,75.21 arc90 69.52,77.57 22.73,77.57 arc90 21.74,76.58 21.74,65.63 arc90 LEFT.6
N$70  (via drill 0.35)
  Top 0.152: U$2.B arc90 224.88,60.95 v230.78,60.95 | U$4.B 14.56,5.38 arc90 12.03,7.92 6.96,7.92 arc-90 4.32,10.57 4.32,55.47 arc-90 7.42,58.57 12.03,58.57 arc90 14.56,61.11 U$3.B
  Bottom 0.152: U$5.B 224.12,4.85 arc-90 226.66,7.39 227.56,7.39 arc90 230.18,10.01 230.18,59.64 arc90 230.78,60.24 v230.78,60.95 arc-90 230.2,61.53 230.2,70.84 arc90 221.16,79.88 43.36,79.88 arc90 40.82,77.34 40.82,68.5 arc-90 RIGHT.5 arc-90 37.41,65.1 arc90 36.75,64.44 36.75,64.03 arc-90 35.56,62.84 20.85,62.84 arc90 20.04,62.03 arc-90 19.73,61.72 17.6,61.72 U$3.B
N$72  (via drill 0.35)
  Top 0.152: D48.A 92.66,6.43 arc90 90.98,8.1 84.67,8.1 arc-90 81.27,11.51 v81.27,13.32 | v92.69,20.68 102.21,20.68 arc90 103.61,22.07 103.61,22.53 arc-90 104.95,23.88 v108.38,23.88 | 2.P$1 arc-90 121.26,15.95 121.26,21.01 arc90 118.39,23.88 v112.09,23.88
  Bottom 0.152: v81.27,13.32 81.52,13.58 81.52,19.76 arc-90 83.81,22.04 91.32,22.04 arc-90 v92.69,20.68 | v108.38,23.88 v112.09,23.88
N$74
  Top 0.152: 2.P$2 128.88,16.43 arc90 129.92,15.39 130.2,15.39 arc90 131.39,16.59 131.39,19.86 arc90 129.46,21.79 129.46,35.64 arc90 37.P$2 arc90 129.46,36.76 129.46,54.68 arc90 27.P$2 arc90 129.46,55.8 129.46,73.73 arc90 17.P$2 128.88,75.64 arc90 126.03,78.49 22.73,78.49 arc90 20.83,76.58 20.83,58.5 arc90 23.06,56.26 LEFT.9
N$75  (via drill 0.35)
  Top 0.152: 49.P$2 arc90 186.44,17.59 186.44,35.77 arc90 310.P$2 arc90 186.44,36.63 186.44,54.81 arc90 210.P$2 arc90 186.44,55.67 186.44,73.85 arc90 110.P$2 185.88,76.86 arc90 183.34,79.4 22.73,79.4 arc90 19.91,76.58 19.91,74.43 arc-90 v19,73.52 | LEFT.12 22.15,48.64 arc-90 19.91,50.88 19.91,55.27 arc90 17.96,57.23 arc-90 17.12,58.06 arc-90 v18.07,59.02 v18.08,59.02
  Bottom 0.152: v19,73.52 arc-90 20.62,71.89 20.62,65.73 arc-90 18.69,63.8 10.03,63.8 arc90 7.8,61.57 arc90 10.06,59.31 17.79,59.31 arc-90 v18.08,59.02
N$93
  Top 0.152: 1.P$2 111.63,17.22 | 111.63,17.22 46.P$2 | 111.63,17.22 arc90 113.49,19.07 113.49,20.07 arc90 111.81,21.74 111.48,21.74 arc-90 110.44,22.78 110.44,35.61 arc90 36.P$2 arc90 110.44,36.78 110.44,54.66 arc90 26.P$2 arc90 110.44,55.83 110.44,73.71 arc90 16.P$2 109.88,75.64 arc90 107.34,78.18 22.73,78.18 arc90 21.13,76.58 21.13,61.04 arc90 23.37,58.8 LEFT.8
N$123
  Top 0.152: RIGHT.3 39.75,71.5 arc90 40.95,72.69 40.95,74.98 arc-90 42.93,76.96 55.04,76.96 arc-90 57.58,74.42 U$1.B U$1.A
N$126
  Top 0.152: 4.P$2 arc90 139.4,16.2 146.87,16.2 arc90 47.P$2 arc90 148.87,16.23 149.38,16.23 arc90 151.05,17.91 151.05,20.78 arc90 149.76,22.07 arc-90 148.46,23.37 148.46,35.68 arc90 38.P$2 arc90 148.44,36.69 148.44,54.75 arc90 28.P$2 arc90 148.44,55.73 148.44,73.79 arc90 18.P$2 147.88,76.25 arc90 145.34,78.79 22.73,78.79 arc90 20.52,76.58 20.52,55.96 arc90 22.76,53.72 LEFT.10
N$128  (via drill 0.35)
  Top 0.152: 48.P$2 arc90 167.46,17.64 167.46,35.72 arc90 39.P$2 arc90 167.46,36.68 167.46,54.76 arc90 29.P$2 arc90 167.46,55.72 167.46,73.8 arc90 19.P$2 166.88,76.86 arc90 164.65,79.1 22.73,79.1 arc90 20.22,76.58 20.22,73.8 arc-90 v19,72.61 | LEFT.11 22.45,51.18 arc-90 20.22,53.42 20.22,55.7 arc90 v17.75,58.17
  Bottom 0.152: v19,72.61 arc-90 20.32,71.29 20.32,65.73 arc-90 18.69,64.11 10.03,64.11 arc90 7.49,61.57 7.49,61.47 arc90 9.96,59 16.91,59 arc-90 v17.75,58.17

### Text on the board
bPlace: Chip Side | Down | Designed By Kacper Wlodarczyk & Harry Herring | Polarity Works CRBN Featherlight